# EAGLE design esp-robotics-board (EAGLE 7.5.0)
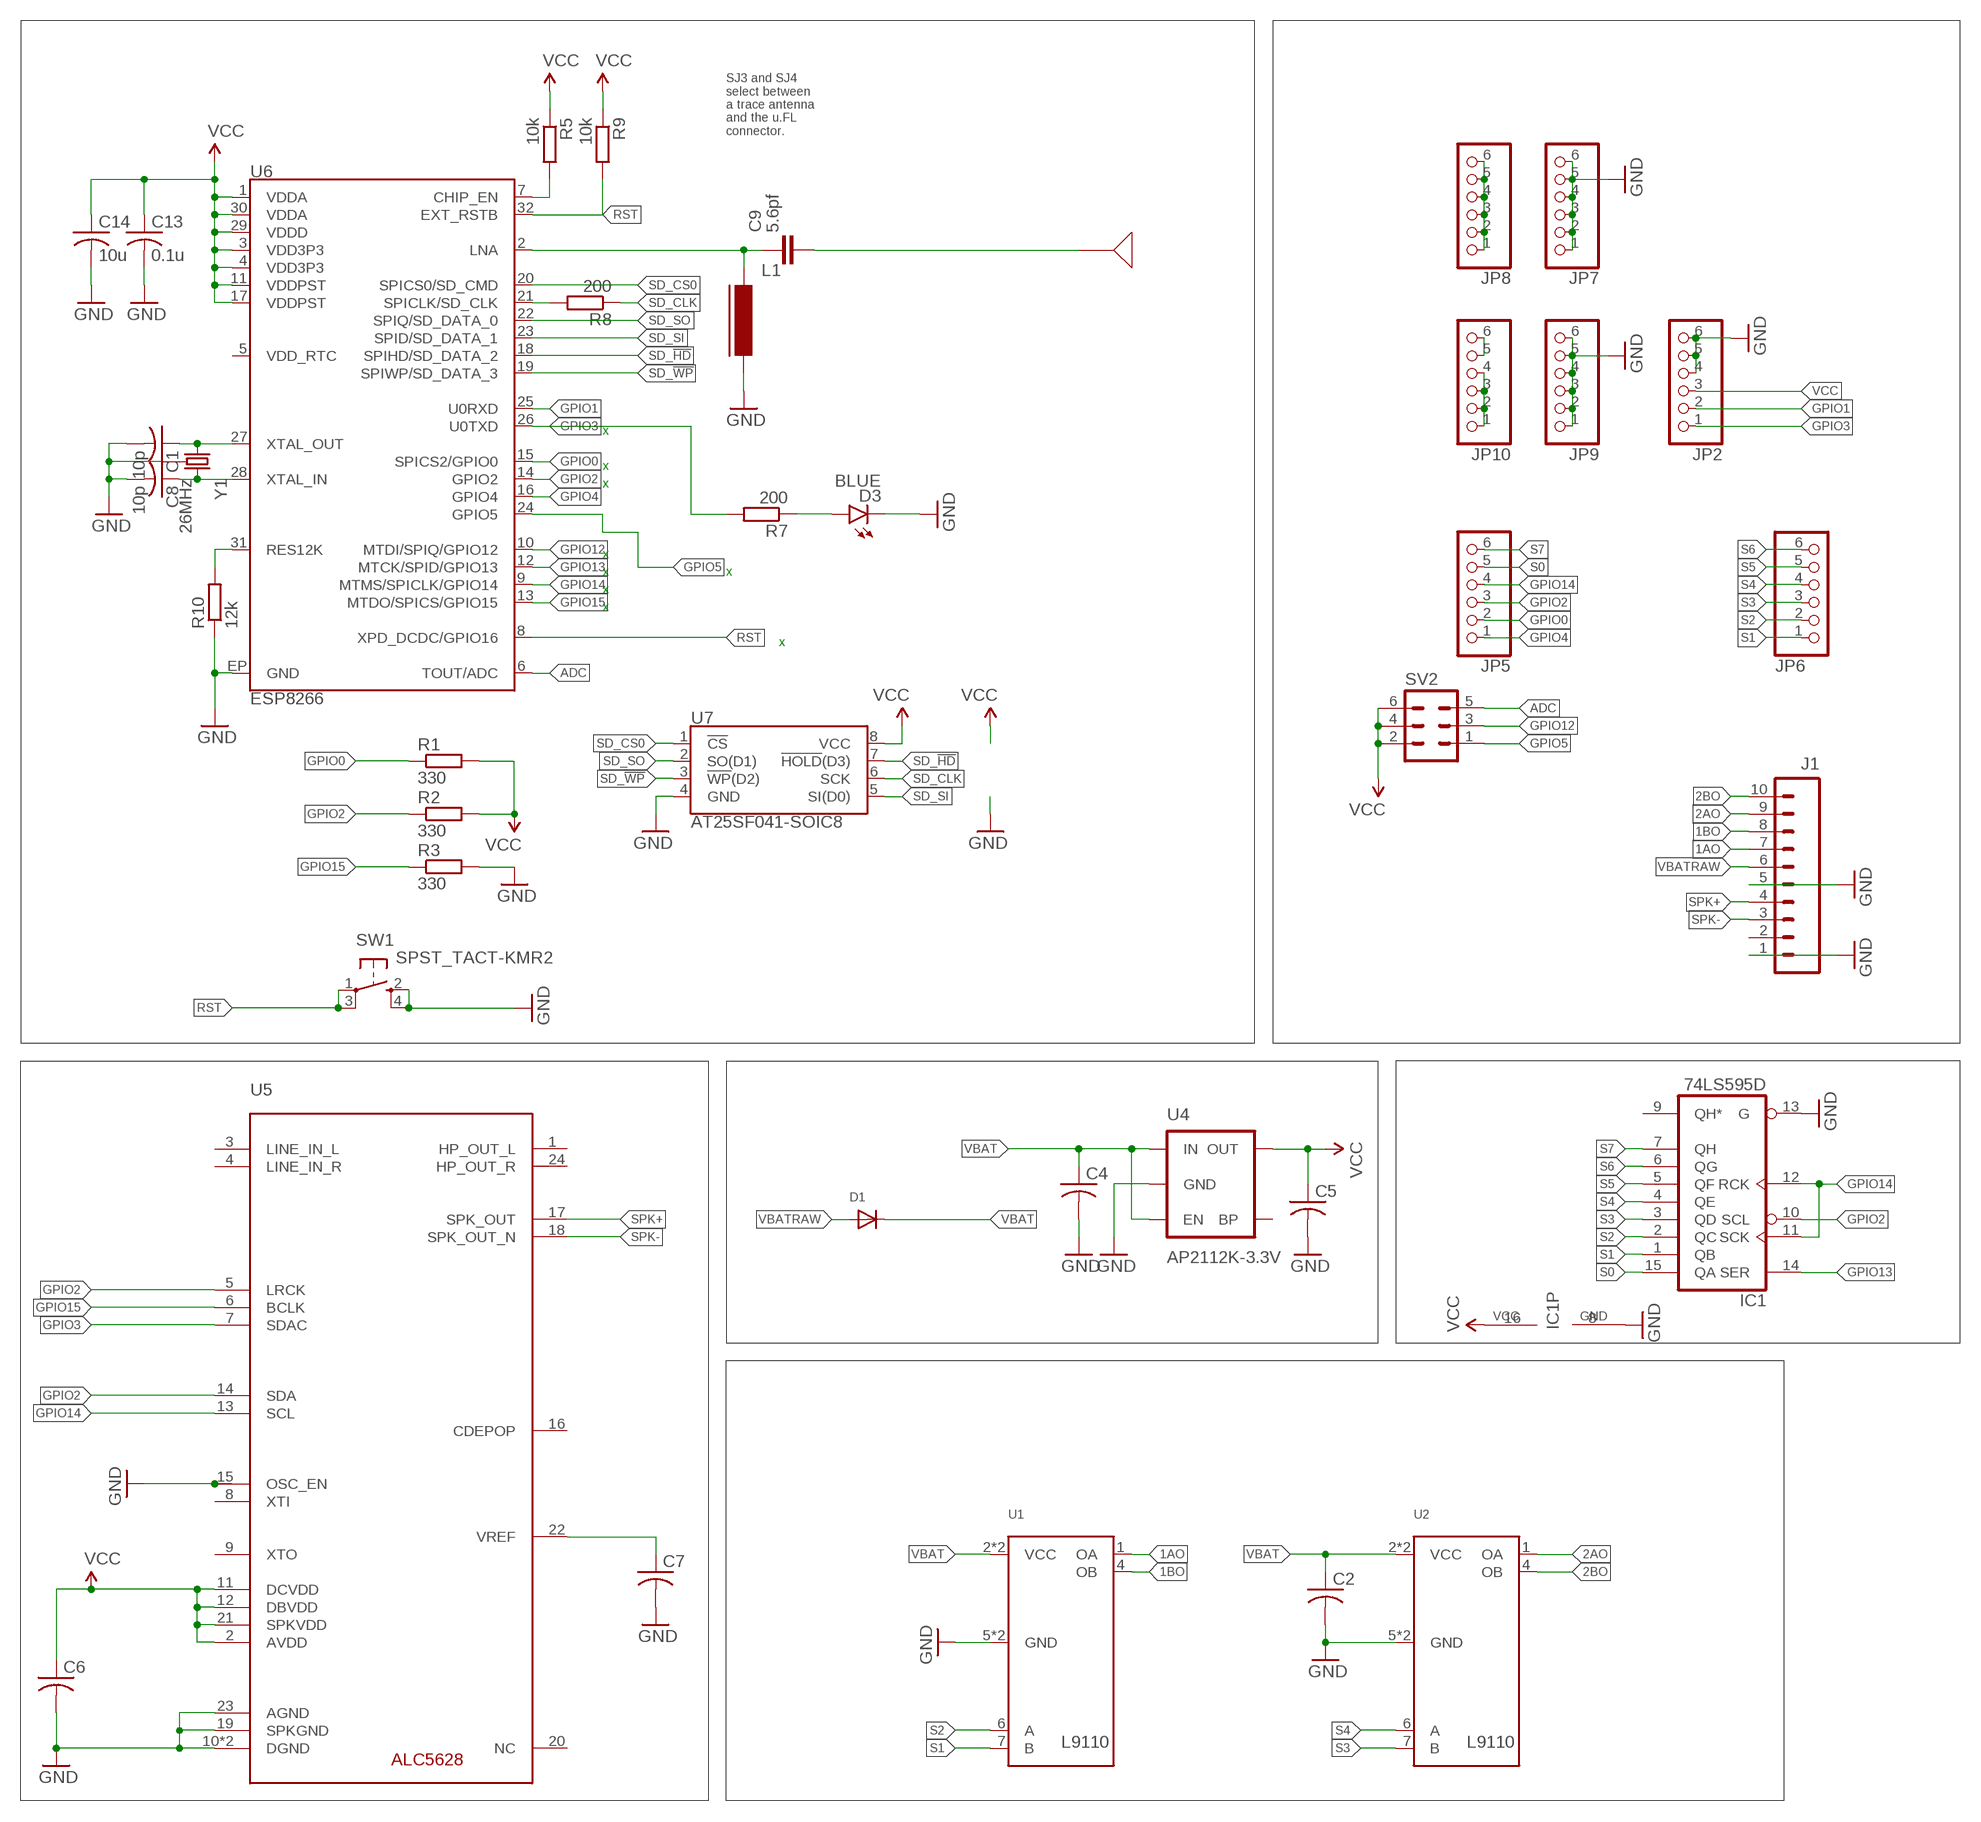
[diagram p0: schematic, sheet 1]

## Parts
C1  10p  C-USC0402  [C0402]
C2  C-USC0805  [C0805]
C4  C-USC0805  [C0805]
C5  C-USC0805  [C0805]
C6  C-USC0402  [C0402]
C7  C-USC0402  [C0402]
C8  10p  C-USC0402  [C0402]
C9  5.6pf  CAPACITOR_NPOL-0402  [C402]
C13  0.1u  C-USC0402  [C0402]
C14  10u  C-USC0402  [C0402]
D1  DIODESMA  [SMADIODE]
D3  BLUE  LED-BLUE0603  [LED-0603]
IC1  74LS595D  [SO16]
J1  M10SILK_FEMALE_PTH  [1X10]
JP2  PINHD-1X6  [1X06]
JP5  PINHD-1X6  [1X06]
JP6  PINHD-1X6  [1X06]
JP7  PINHD-1X6  [1X06]
JP8  PINHD-1X6  [1X06]
JP9  PINHD-1X6  [1X06]
JP10  PINHD-1X6  [1X06]
L1  FERRITE-0402  [FB402]
R1  330  R-EU_R0402  [R0402]
R2  330  R-EU_R0402  [R0402]
R3  330  R-EU_R0402  [R0402]
R5  10k  R-EU_R0402  [R0402]
R7  200  R-EU_R0402  [R0402]
R8  200  R-EU_R0402  [R0402]
R9  10k  R-EU_R0402  [R0402]
R10  12k  R-EU_R0402  [R0402]
SV2  MA03-2  [MA03-2]
SW1  SPST_TACT-KMR2  [KMR2]
U1  L9110SMT  [8S1]
U2  L9110SMT  [8S1]
U4  AP2112K-3.3V  V_REG_LDOSMD  [SOT23-5]
U5  ALC5628  [QFN24]
U6  ESP8266  [QFN32]
U7  AT25SF041-SOIC8  [SO08]
U$1  AN9520  [AN9520]
Y1  26MHz  CRYSTAL-GROUNDED3.2X2.5  [CRYSTAL-SMD-3.2X2.5]

## Nets
1AO: J1.7 U1.1(OA)
1BO: J1.8 U1.4(OB)
2AO: J1.9 U2.1(OA)
2BO: J1.10 U2.4(OB)
ADC: SV2.5 U6.6(TOUT/ADC)
CHIP_EN: R5.2 U6.7(CHIP_EN)
GND: C1.2 C2.2 C4.2 C5.2 C6.2 C7.2 C8.2 C13.2 C14.2 D3.C IC1.8(GND) IC1.13(G) J1.1 J1.5 JP2.4 JP2.5 JP2.6 JP7.1 JP7.2 JP7.3 JP7.4 JP7.5 JP7.6 JP9.1 JP9.2 JP9.3 JP9.4 JP9.5 JP9.6 L1.2 R3.2 R10.1 SW1.2(S) SW1.4(S1) U1.5(GND) U1.8(GND) U2.5(GND) U2.8(GND) U4.2(GND) U5.10(DGND) U5.19(SPKGND) U5.23(AGND) U5.PAD(DGND) U6.EP(GND) U7.4(GND) Y1.2(GND) Y1.4(GND)
GPIO0: JP5.2 R1.1 U6.15(SPICS2/GPIO0)
GPIO1: JP2.2 U6.25(U0RXD)
GPIO2: IC1.10(SCL) JP5.3 R2.1 U5.5(LRCK) U5.14(SDA) U6.14(GPIO2)
GPIO3: JP2.1 R7.2 U5.7(SDAC) U6.26(U0TXD)
GPIO4: JP5.1 U6.16(GPIO4)
GPIO5: SV2.1 U6.24(GPIO5)
GPIO12: SV2.3 U6.10(MTDI/SPIQ/GPIO12)
GPIO13: IC1.14(SER) U6.12(MTCK/SPID/GPIO13)
GPIO14: IC1.11(SCK) IC1.12(RCK) JP5.4 U5.13(SCL) U6.9(MTMS/SPICLK/GPIO14)
GPIO15: R3.1 U5.6(BCLK) U6.13(MTDO/SPICS/GPIO15)
LNA: C9.1 L1.1 U6.2(LNA)
LNA2: C9.2 U$1.FEED
N$1: D3.A R7.1
N$6: C7.1 U5.22(VREF)
N$10: U5.15(OSC_EN) ; supply symbol labelled GND
N$11: R10.2 U6.31(RES12K)
N$16: C8.1 U6.28(XTAL_IN) Y1.3
N$17: C1.1 U6.27(XTAL_OUT) Y1.1
RST: R9.2 SW1.1(P) SW1.3(P1) U6.8(XPD_DCDC/GPIO16) U6.32(EXT_RSTB)
S0: IC1.15(QA) JP5.5
S1: IC1.1(QB) JP6.1 U1.7(B)
S2: IC1.2(QC) JP6.2 U1.6(A)
S3: IC1.3(QD) JP6.3 U2.7(B)
S4: IC1.4(QE) JP6.4 U2.6(A)
S5: IC1.5(QF) JP6.5
S6: IC1.6(QG) JP6.6
S7: IC1.7(QH) JP5.6
SD_!HD!: U6.18(SPIHD/SD_DATA_2) U7.7(!HOLD!(D3))
SD_!WP!: U6.19(SPIWP/SD_DATA_3) U7.3(!WP!(D2))
SD_CLK: R8.1 U7.6(SCK)
SD_CLK0: R8.2 U6.21(SPICLK/SD_CLK)
SD_CS0: U6.20(SPICS0/SD_CMD) U7.1(!CS!)
SD_SI: U6.23(SPID/SD_DATA_1) U7.5(SI(D0))
SD_SO: U6.22(SPIQ/SD_DATA_0) U7.2(SO(D1))
SPK+: J1.4 U5.17(SPK_OUT)
SPK-: J1.3 U5.18(SPK_OUT_N)
VBAT: C2.1 C4.1 D1.C JP8.1 JP8.2 JP8.3 JP8.4 JP8.5 JP8.6 JP10.5 JP10.6 U1.2(VCC) U1.3(VCC) U2.2(VCC) U2.3(VCC) U4.1(IN) U4.3(EN)
VBATRAW: D1.A J1.6
VCC: C5.1 C6.1 C13.1 C14.1 IC1.16(VCC) JP2.3 JP10.1 JP10.2 JP10.3 JP10.4 R1.2 R2.2 R5.1 R9.1 SV2.2 SV2.4 SV2.6 U4.5(OUT) U5.2(AVDD) U5.11(DCVDD) U5.12(DBVDD) U5.21(SPKVDD) U6.1(VDDA) U6.3(VDD3P3) U6.4(VDD3P3) U6.11(VDDPST) U6.17(VDDPST) U6.29(VDDD) U6.30(VDDA) U7.8(VCC)
Unconnected: IC1.9(QH*) J1.2 U4.4(BP) U5.1(HP_OUT_L) U5.3(LINE_IN_L) U5.4(LINE_IN_R) U5.8(XTI) U5.9(XTO) U5.16(CDEPOP) U5.20(NC) U5.24(HP_OUT_R) U6.5(VDD_RTC)

## Notes on the sheet
- SJ3 and SJ4
  select between
  a trace antenna
  and the u.FL 
  connector.
- x
- x
- x
- x
- x | x
- x
- x
- x

## Library data of the parts
C1 C2 C4-C8 C13 C14 = adafruit:C-US: CAPACITOR, American symbol
C9 = dp_devices:CAPACITOR_NPOL: Non-Polarized capacitor in various packages
D1 = adafruit:DIODE: Diode SMADIODE - SMA Surface Mount Package 20V 1A Schottky Diode Digikey: 641-1014-6-ND DO-1N4148 - Through Hole Small Current Diode SOD-123 20V 1 A (.5mV Vf) Schottky Diode - Digikey: MBRX120TPMSCT-ND SOD-323 10V 570mA (.38mV Vf, 3ns) Schottky Diode - Digikey: ZLLS410CT-ND SOD-523 30V 30mA Schottky Diode (RB751S-40TE61) - Digikey: RB751S-40TE61CT-ND SOT23-R/W - SOT23 Package (R = Solder Paste/Reflow Ovens, W = Hand-Soldering) BAT54Film 40V 300mA - Digikey: 497-7162-1-ND
D3 = SparkFun-LED:LED-BLUE: Blue LEDs for production use Various blue LEDs stocked by SparkFun production 0603 - DIO-08575 Rebel - DIO-09553 1206 - DIO-09911; PROD_ID: DIO-08575
IC1 = 74xx-us:74*595: 8-bit SHIFT REGISTER, output latch
J1 = SparkFun-Connectors:M10: Header 10 Standard 10-pin 0.1" header. Use with straight break away headers (SKU : PRT-00116), right angle break away headers (PRT-00553), swiss pins (PRT-00743), machine pins (PRT-00117), and female headers (PRT-00115).; PROD_ID: CONN-11563
JP2 JP5-JP10 = adafruit:PINHD-1X6: PIN HEADER
L1 = dp_devices:FERRITE: Ferrite bead in various packages
R1-R3 R5 R7-R10 = rcl:R-EU_: RESISTOR, European symbol
SV2 = con-lstb:MA03-2: PIN HEADER; OC_FARNELL: unknown; OC_NEWARK: unknown
SW1 = adafruit:SPST_TACT: SMT 6mm switch, EVQQ2 series http://www.ladyada.net/library/eagle
U1 U2 = L9110h:L9110
U4 = SparkFun-PowerIC:V_REG_LDO: Voltage Regulator LDO Standard 150mA LDO voltage regulator in SOT-23 layout. Micrel part MIC5205. BP (by-pass) pin is used to lower output noise with 470pF cap.; PROD_ID: VREG-12457
U5 = ALC5628:ALC5628
U6 = esp8266-development-board:ESP8266: Espressif ESP8266 WiFi Smart Connectivity Platform.; PROD_ID: IC-12452
U7 = esp8266-development-board:AT25SF041: SPI Serial Flash Memory with Dual/Quad-IO Support Example: Adesto Technologies AT25SF041-SSHD-T (1265-1131-1-ND) <http://www.digikey.com/product-detail/en/AT25SF041-SSHD-T/1265-1131-1-ND/4824165>; PROD_ID: IC-12455
U$1 = an9520:AN9520
Y1 = things:CRYSTAL-GROUNDED; PROD_ID: XTAL-12454

## Board
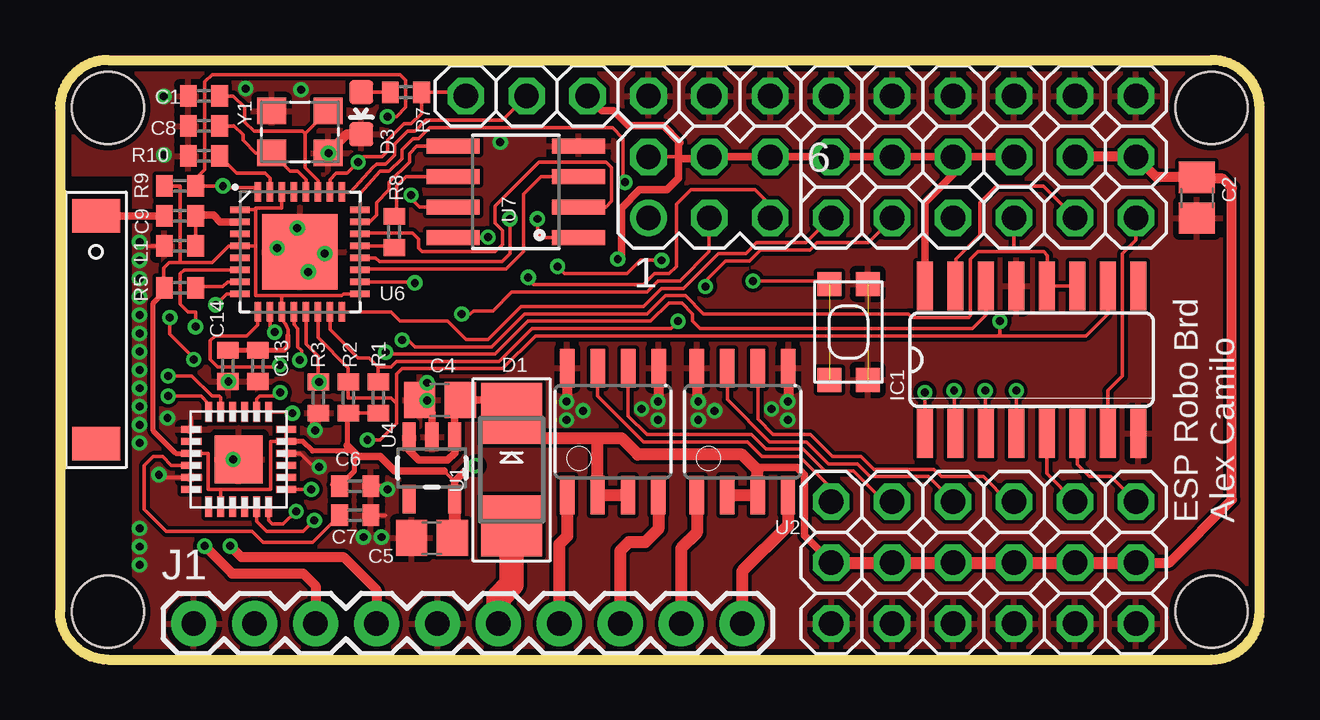
[diagram p1: board, top side]
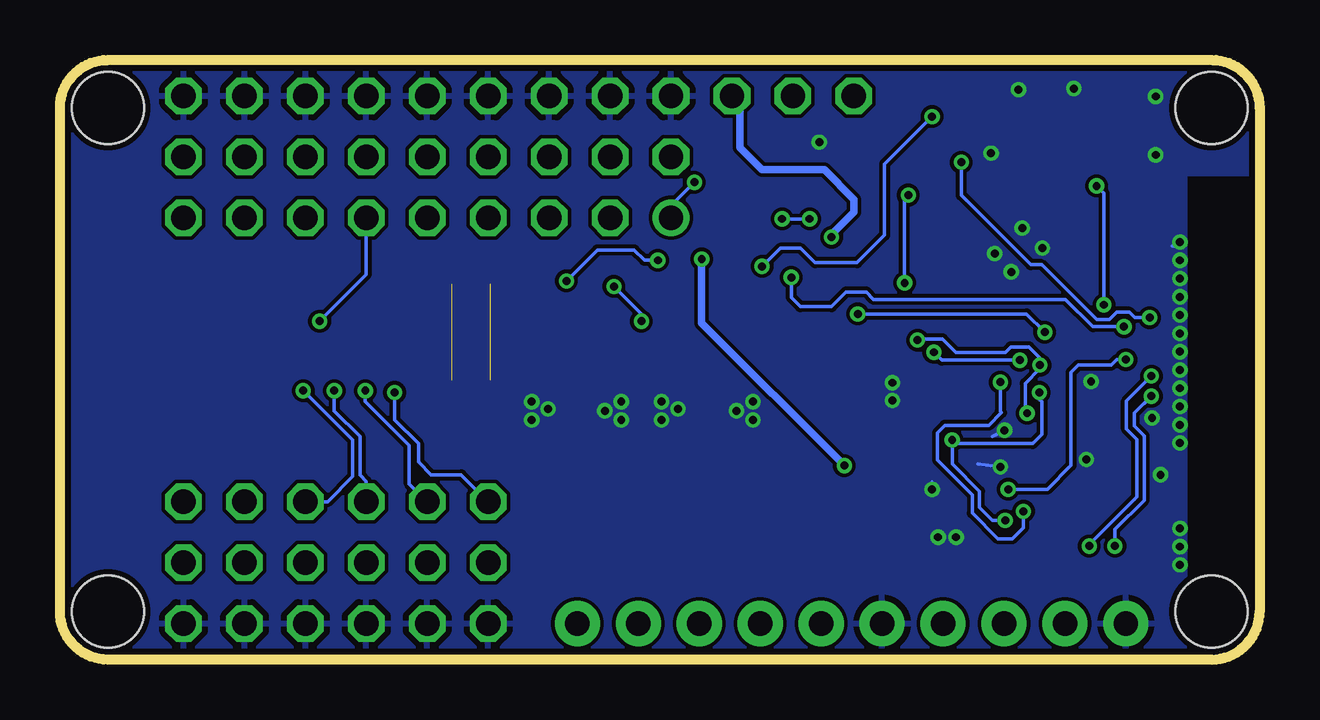
[diagram p2: board, bottom side, seen from below]

Size 50 x 25 mm. Coordinates in mm from the lower left corner, seen from the top.
Outline: 2,0 48,0 arc90 50,2 50,23 arc90 48,25 2,25 arc90 0,23 0,2 arc90 2,0
Copper layers (1*16): Top 0.035mm / dielectric 1.5mm / Bottom 0.035mm
Design rules "SeeedStudio_2layer_DRU_no_angle_20140221": minimum track width 6mil, minimum drill 12mil, track to track 6mil, track to pad 6mil, pad to pad 6mil, via to via 6mil, smd to smd 0mil, copper to edge 10mil, drill to drill 10mil, minimum pad ring 10mil, minimum via ring 6mil, stop-mask expansion 2mil, vias tented up to drill 100mil, thermal gap 10mil
Holes 3 mm at 2,23 2,2 48,2 48,23
tRestrict: area -1.1,0.3 to 3,20.1
bRestrict: area -1.1,0.3 to 3,20.1

### Footprints (pad centres in the part's own frame; a part is rotated, then mirrored left to right if it is on the bottom)
C0402 = smd 0.7 x 0.9: 1 -0.65,0; 2 0.65,0
C0805 = smd 1.3 x 1.5: 1 -0.85,0; 2 0.85,0
C402 = smd 0.7 x 0.9: 1 -0.65,0; 2 0.65,0
SMADIODE = smd 2.54 x 2.54: A 2.349,0; C -2.349,0
LED-0603 = smd 1 x 1: A 0,-0.877; C 0,0.877
SO16 = smd 0.66 x 2.032: 1 -4.445,-3.073; 2 -3.175,-3.073; 3 -1.905,-3.073; 4 -0.635,-3.073; 5 0.635,-3.073; 6 1.905,-3.073; 7 3.175,-3.073; 8 4.445,-3.073; 9 4.445,3.073; 10 3.175,3.073; 11 1.905,3.073; 12 0.635,3.073; 13 -0.635,3.073; 14 -1.905,3.073; 15 -3.175,3.073; 16 -4.445,3.073
1X10 = drill 1.016 pad 1.88: 1 0,0; 2 2.54,0; 3 5.08,0; 4 7.62,0; 5 10.16,0; 6 12.7,0; 7 15.24,0; 8 17.78,0; 9 20.32,0; 10 22.86,0
1X06 = drill 1.016 octagon: 1 -6.35,0; 2 -3.81,0; 3 -1.27,0; 4 1.27,0; 5 3.81,0; 6 6.35,0
FB402 = smd 0.7 x 0.9: 1 -0.65,0; 2 0.65,0
R0402 = smd 0.7 x 0.9: 1 -0.65,0; 2 0.65,0
MA03-2 = drill 1.016: 1 -2.54,-1.27 | drill 1.016 octagon: 2 -2.54,1.27; 3 0,-1.27; 4 0,1.27; 5 2.54,-1.27; 6 2.54,1.27
KMR2 = smd 1 x 1: 1 2,0.8; 2 2,-0.8; 3 -2,0.8; 4 -2,-0.8
8S1 = smd 0.6 x 1.6: 1 -1.905,-2.654; 2 -0.645,-2.654; 3 0.625,-2.654; 4 1.895,-2.654; 5 1.905,2.654; 6 0.635,2.654; 7 -0.635,2.654; 8 -1.905,2.654
SOT23-5 = smd 0.55 x 1.2: 1 -0.95,-1.3; 2 0,-1.3; 3 0.95,-1.3; 4 0.95,1.3; 5 -0.95,1.3
QFN24 = smd 0.85 x 0.3: 1 -1.975,1.25; 2 -1.975,0.75; 3 -1.975,0.25; 4 -1.975,-0.25; 5 -1.975,-0.75; 6 -1.975,-1.25; 13 1.975,-1.25; 14 1.975,-0.75; 15 1.975,-0.25; 16 1.975,0.25; 17 1.975,0.75; 18 1.975,1.25 | smd 0.3 x 0.85: 7 -1.25,-1.975; 8 -0.75,-1.975; 9 -0.25,-1.975; 10 0.25,-1.975; 11 0.75,-1.975; 12 1.25,-1.975; 19 1.25,1.975; 20 0.75,1.975; 21 0.25,1.975; 22 -0.25,1.975; 23 -0.75,1.975; 24 -1.25,1.975 | smd 2 x 2: PAD 0,0
QFN32 = smd 0.8 x 0.285: 1 -2.5,1.75; 2 -2.5,1.25; 3 -2.5,0.75; 4 -2.5,0.25; 5 -2.5,-0.25; 6 -2.5,-0.75; 7 -2.5,-1.25; 8 -2.5,-1.75; 17 2.5,-1.75; 18 2.5,-1.25; 19 2.5,-0.75; 20 2.5,-0.25; 21 2.5,0.25; 22 2.5,0.75; 23 2.5,1.25; 24 2.5,1.75 | smd 0.285 x 0.8: 9 -1.75,-2.5; 10 -1.25,-2.5; 11 -0.75,-2.5; 12 -0.25,-2.5; 13 0.25,-2.5; 14 0.75,-2.5; 15 1.25,-2.5; 16 1.75,-2.5; 25 1.75,2.5; 26 1.25,2.5; 27 0.75,2.5; 28 0.25,2.5; 29 -0.25,2.5; 30 -0.75,2.5; 31 -1.25,2.5; 32 -1.75,2.5 | smd 3.15 x 3.15: EP 0,0
SO08 = smd 0.61 x 2.21: 1 -1.905,-2.616; 2 -0.635,-2.616; 3 0.635,-2.616; 4 1.905,-2.616; 5 1.905,2.616; 6 0.635,2.616; 7 -0.635,2.616; 8 -1.905,2.616
AN9520 = smd 1.4 x 2: FEED 4.75,0; MNT -4.75,0
CRYSTAL-SMD-3.2X2.5 = smd 1.2 x 1.1: 1 -1.175,-0.875; 2 1.175,-0.875; 3 1.175,0.875; 4 -1.175,0.875

### Placement (x,y rotation side)
C1  6,23.5 180 top
C2  47.39,19.26 270 top
C4  15.84,10.82 180 top
C5  15.5,5.06 180 top
C6  12.31,7.23 0 top
C7  12.31,6.02 0 top
C8  6,22.25 180 top
C9  5,18.5 180 top
C13  8.25,12.25 270 top
C14  7,12.25 270 top
D1  18.83,7.92 270 top
D3  12.56,22.78 180 top
IC1  40.5,12.5 0 top
J1  5.57,1.5 0 top
JP2  23.26,23.5 0 top
JP5  38.5,18.42 0 top
JP6  38.5,6.58 0 top
JP7  38.5,1.5 0 top
JP8  38.5,4.04 0 top
JP9  38.5,23.5 0 top
JP10  38.5,20.96 0 top
L1  5,17.25 180 top
R1  13.27,10.92 270 top
R2  12.02,10.92 270 top
R3  10.77,10.92 270 top
R5  5,15.5 0 top
R7  14.42,23.65 0 top
R8  13.93,17.83 270 top
R9  5,19.75 0 top
R10  6,21 0 top
SV2  27.07,19.69 0 top
SW1  32.87,13.66 90 top
U1  23.05,9.5 0 top
U2  28.45,9.5 0 top
U4  15.5,7.99 180 top
U5  7.45,8.35 90 top
U6  10,17 0 top
U7  19,19.5 90 top
U$1  1.5,13.75 90 top
Y1  10,22 180 top

### Tracks (layer width: path | path; a pad name or v marks a point on that pad's centre or on a via)
1AO
  Top 0.508: U1.1 21.14,5.14 20.81,4.81 J1.7
1BO
  Top 0.508: U1.4 24.95,5.44 24.39,4.89 23.71,4.89 23.35,4.53 J1.8
2AO
  Top 0.508: U2.1 26.55,5.29 25.89,4.63 J1.9
2BO
  Top 0.508: U2.4 30.34,5.58 28.43,3.67 J1.10
ADC  (via drill 0.33)
  Top 0.152: U6.6 7.47,16.25 7.25,16.24 5.17,16.24 5.02,16.09 5.02,14.81 5.34,14.49 5.65,14.49 v5.65,13.88 | v19.52,15.94 19.52,15.71 19.59,15.78 19.75,15.63 24.32,15.63 24.77,16.09 25.38,16.09 25.69,16.39 25.69,18.98 26.3,19.59 28.96,19.59 29.61,18.95 SV2.5
  Bottom 0.152: v19.52,15.94 19.52,15.1 19.14,14.72 17.84,14.72 17.23,15.33 16.39,15.33 16.09,15.02 8.09,15.02 6.94,13.88 v5.65,13.88
CHIP_EN
  Top 0.152: 5.9,15.75 R5.2 5.7,15.55 6.79,15.55 6.99,15.75 U6.7
GND  (via drill 0.33)  (1 unrouted)
  Top 0.152: R3.2 10.49,9.85 v10.63,9.56 | L1.2 3.59,17.25 3.57,17.23 | C6.2 13.63,7.23 v13.65,7.1 | C7.2 13.56,6.02 | U5.23 4.31,7.6 v4.12,7.71 | U5.19 5.47,10.12 | U5.10 10.01,8.6 10.45,8.16
  Top 0.305: U4.2 15.5,10.31 C4.2
  Top 0.406: U1.8 21.14,10.78 v21.12,10.75 | U1.5 24.95,10.78 v24.93,10.75 | U2.8 26.55,10.81 v26.6,10.75 | U2.5 30.36,10.77 v30.34,10.75 | Y1.4 11.95,21.9 D3.C
  Bottom 0.152: v10.63,9.56 11.13,9.31 | 3.57,17.23 3.65,17.23 | v13.65,7.1 13.65,7.4 | v4.12,7.71 4.05,7.78 | v10.8,8.04 11.74,8.16
  Bottom 0.406: v21.12,10.75 21.19,10.83 | v24.93,10.75 24.93,10.68 | v26.6,10.75 26.6,10.68 | v30.34,10.75 30.26,10.75
  other vias: 13.4,5.11 12.65,5.11 21.12,9.99 21.8,10.37 24.93,9.99 24.24,10.45 26.6,9.99 27.29,10.37 30.34,9.99 29.65,10.45 4.48,10.07 9.89,17.99 9.06,17.15 11.04,16.93 10.35,16.16 10.05,23.76 7.74,23.81 11.19,21.12 4.33,23.48 4.33,21.04 7.02,11.59 7.22,8.34 3.32,9.79 3.32,10.55 3.32,11.31 3.32,12.07 3.32,12.84 3.32,13.6 3.32,14.36 3.32,15.12 3.32,15.88 3.32,16.65 3.32,17.41 3.32,9.03 3.32,5.47 3.32,4.71 3.32,3.95 18.35,21.57 15.3,11.54 15.3,10.8
  pour Bottom: -2.05,26.91 53.27,26.91 53.27,-4.18 -1.82,-4.18 -1.82,19.82
  pour Top: -1.44,28.36 54.49,28.36 54.49,-3.42 -1.36,-3.42 -1.36,26.53
GPIO0  (via drill 0.33)
  Top 0.152: U6.15 11.25,13.76 12.43,12.58 12.89,12.58 13.27,12.2 | 13.27,12.2 R1.1 | 13.27,12.2 13.8,12.2 14.03,12.43 18.3,12.43 19.67,13.8 25.46,13.8 v25.77,14.11 | v26.91,15.55 26.91,15.78 27.75,16.62 28.74,16.62 29.19,17.08 31.25,17.08 31.56,17.38 33.69,17.38 34.69,18.38 JP5.2
  Bottom 0.152: v25.77,14.11 25.77,14.41 v26.91,15.55
GPIO1
  Top 0.152: U6.25 12.11,19.5 13.04,20.51 13.19,20.66 13.57,20.66 13.95,21.04 13.95,21.5 14.49,22.03 14.79,22.03 15.25,22.49 18.44,22.49 JP2.2
GPIO2  (via drill 0.33)
  Top 0.152: U6.14 10.75,13.42 12.02,12.15 R2.1 12.02,10.91 13.8,10.91 14.03,10.68 | U5.5 8.2,5.76 8.62,5.34 10.14,5.34 v10.6,5.8 | v12.81,9.15 13.34,9.15 14.03,9.84 14.03,10.68 | IC1.10 43.67,14.41 42.76,13.5 39.1,13.5 | 14.03,10.68 14.03,11.9 14.26,12.12 18.45,12.12 19.82,13.5 39.1,13.5 | v39.18,14.11 39.18,13.57 39.1,13.5 | U5.14 8.2,10.87 8.32,10.98 9,10.98 v9.18,11.13
  Bottom 0.152: v10.6,5.8 11.13,5.8 11.67,6.33 11.67,7.02 12.81,8.16 v12.81,9.15 12.66,9 9.46,9 9.08,9.38 9.08,10.75 9.15,10.83 v9.18,11.13 | JP5.3 37.23,16.05 v39.18,14.11
GPIO3  (via drill 0.33)
  Top 0.152: U5.7 v10.47,7.1 | U6.26 11.25,20.01 11.52,20.28 11.97,20.28 v12.43,20.74 12.66,20.96 13.42,20.96 13.65,21.19 13.65,21.65 14.34,22.34 14.64,22.34 15.07,22.77 R7.2 16.76,23.65 JP2.1 16.81,23.4 | v5.57,12.51 5.57,12.58 4.58,13.57 v4.58,14.26
  Bottom 0.152: 10.47,7.15 v10.47,7.1 8.85,7.1 7.86,8.09 7.86,11.97 7.55,12.28 6.18,12.28 5.95,12.51 v5.57,12.51 | v12.43,20.74 12.43,19.36 9.53,16.47 9.08,16.47 6.79,14.18 6.26,14.18 5.95,14.49 5.42,14.49 5.19,14.26 v4.58,14.26
GPIO4
  Top 0.152: U6.16 11.76,14.49 13.8,14.49 14.18,14.11 16.16,14.11 16.93,13.34 17.84,13.34 19.21,14.72 24.32,14.72 25.08,15.48 25.99,15.48 27.44,16.93 28.58,16.93 29.04,17.38 31.1,17.38 32.14,18.42 JP5.1
GPIO5  (via drill 0.33)
  Top 0.152: U6.24 12.5,19.43 13.34,20.36 13.72,20.36 14.26,20.89 14.26,21.27 14.72,21.73 14.95,21.73 15.4,22.18 23.02,22.18 23.48,21.73 23.48,20.05 23.55,19.97 v23.55,19.9
  Bottom 0.152: v23.55,19.9 24.55,18.91 24.55,18.4 | 24.55,18.37 24.55,18.4 | 24.55,18.4 SV2.1
GPIO12  (via drill 0.33)
  Top 0.152: U6.10 8.75,13.88 v8.95,13.65 | v16.75,14.41 17.1,14.41 17.23,14.54 18.04,14.54 18.83,15.33 24.47,15.33 24.93,15.78 25.84,15.78 27.06,17 SV2.3
  Bottom 0.152: v16.75,14.41 9.71,14.41 v8.95,13.65
GPIO13  (via drill 0.33)
  Top 0.152: U6.12 9.75,13.97 9.91,13.8 9.91,13.04 10.07,12.89 10.07,12.51 v9.99,12.48 | v13.57,12.81 13.65,12.73 18.14,12.73 19.52,14.11 24.62,14.11 25.38,14.87 25.92,14.87 26.38,14.41 26.38,14.11 26.68,13.8 38.03,13.8 38.59,14.36 IC1.14
  Bottom 0.152: 13.27,12.51 v13.57,12.81 13.24,12.48 v9.99,12.48
GPIO14  (via drill 0.33)
  Top 0.152: U6.9 8.24,13.95 7.78,13.5 6.46,13.5 6.26,13.29 6.26,12.51 6.56,12.2 9.08,12.2 v9.15,12.28 | U5.13 9.58,10.32 v9.69,10.27 | v14.26,13.32 14.49,13.34 14.79,13.04 17.99,13.04 19.36,14.41 24.47,14.41 25.23,15.17 26.07,15.17 26.83,14.41 35.37,14.41 35.52,14.26 37.88,14.26 37.96,14.34 37.96,16.7 38.26,17 39.63,17 | IC1.11 IC1.12 41.16,15.6 41.16,16.85 41.01,17 39.63,17 | JP5.4 39.77,17.14 39.63,17
  Bottom 0.152: 9.76,10.22 v9.69,10.27 9.76,10.35 9.76,11.52 9.15,12.12 v9.15,12.28 9.15,12.58 9.61,13.04 10.37,13.04 10.6,12.81 12.66,12.81 13.22,13.37 14.26,13.37 v14.26,13.32
GPIO15  (via drill 0.33)
  Top 0.152: U5.6 8.7,5.8 8.85,5.65 9.31,5.65 v9.84,6.18 | U6.13 10.25,13.16 10.75,12.66 10.75,11.59 R3.1 v10.8,11.57
  Bottom 0.152: v9.84,6.18 9.84,5.5 10.3,5.04 10.91,5.04 11.97,6.11 11.97,6.87 13.42,8.32 13.42,9.46 13.12,9.76 11.29,9.76 10.75,10.3 10.8,10.35 v10.8,11.57
LNA
  Top 0.152: 5.9,18.25 C9.1 L1.1
  Top 0.305: U6.2 6.69,18.25 6.41,18.53 5.68,18.53 C9.1
LNA2
  Top 0.305: C9.2 U$1.FEED
N$1
  Top 0.152: D3.A R7.1
N$6
  Top 0.152: U5.22 4.64,8.1 4.28,8.47 3.9,8.47 3.52,8.09 3.52,6.26 4.43,5.34 8.01,5.34 8.47,4.89 10.52,4.89 C7.1
N$11
  Top 0.152: U6.31 8.75,20.07 8.54,20.28 7.37,20.28 R10.2
N$16
  Top 0.152: U6.28 10.25,20.02 9.91,20.36 9.6,20.36 Y1.3 8.16,21.12 7.63,21.65 7.63,21.88 7.25,22.26 7.24,22.25 C8.1
N$17
  Top 0.152: U6.27 10.75,19.98 10.22,20.51 10.22,21.92 | 10.22,21.92 Y1.1 | 10.22,21.92 10.11,22.03 8.09,22.03 7.71,22.41 7.71,23.02 7.23,23.5 C1.1
RST  (via drill 0.33)  (1 unrouted)
  Top 0.152: 8.19,19.44 U6.32 8.08,19.67 6.79,19.67 v6.79,19.75 R9.2 5.65,20.05 6.03,20.43 6.03,24.09 6.33,24.39 14.18,24.39 14.41,24.16 14.41,23.02 14.03,22.64 v13.65,22.64 | U6.8 6.94,15.25 v6.49,14.79 | v20.74,16.39 21.04,16.09 23.63,16.09 24.19,16.65 v25.08,16.65 | v28.89,15.78 31.94,15.78 SW1.1
  Bottom 0.152: v6.79,19.75 6.49,19.44 v6.49,14.79 | v13.65,22.64 15.63,20.66 15.63,17.69 16.77,16.55 18.53,16.55 19.14,17.15 19.97,17.15 v20.74,16.39 | v25.08,16.65 25.64,16.65 26.07,17.08 27.59,17.08 v28.89,15.78
S0
  Top 0.152: IC1.15 37.35,15.55 37.35,16.7 38.34,17.69 38.34,19.06 39.02,19.75 40.98,19.75 JP5.5
S1  (via drill 0.33)
  Top 0.152: U1.7 22.41,10.98 24.32,9.08 28.66,9.08 29.27,8.47 30.82,8.47 32.17,7.11 JP6.1 | IC1.1 v36.05,11.13
  Bottom 0.152: v36.05,11.13 36.05,9.99 35.06,9 35.06,8.24 34.53,7.71 33.28,7.71 JP6.1
S2  (via drill 0.33)
  Top 0.152: IC1.2 37.27,9.48 v37.27,11.21 | U1.6 23.68,10.17 24.47,9.38 28.81,9.38 29.42,8.77 30.97,8.77 31.89,7.86 33.08,7.86 34.36,6.58 JP6.2
  Bottom 0.152: 37.27,11.29 v37.27,11.21 37.27,10.75 35.44,8.93 35.44,7.33 JP6.2
S3  (via drill 0.33)
  Top 0.152: U2.7 27.82,10.84 29.57,9.08 31.12,9.08 32.04,8.16 33.23,8.16 33.77,7.63 36.2,7.63 37.23,6.6 JP6.3 | IC1.3 38.57,9.46 v38.57,11.21
  Bottom 0.152: 38.57,11.29 v38.57,11.21 38.57,10.37 37.5,9.31 37.5,7.71 37.23,7.44 JP6.3
S4  (via drill 0.33)
  Top 0.152: U2.6 29.09,10.02 29.73,9.38 31.28,9.38 32.19,8.47 33.38,8.47 33.92,7.93 36.43,7.93 36.74,7.63 38.49,7.63 39.54,6.58 JP6.4 | IC1.4 v39.86,11.21
  Bottom 0.152: JP6.4 38.85,6.58 37.8,7.63 37.8,9.15 v39.86,11.21
S5
  Top 0.152: IC1.5 41.13,7.75 JP6.5
S6
  Top 0.152: IC1.6 42.41,8.13 42.91,7.63 43.8,7.63 JP6.6
S7
  Top 0.152: JP5.6 44.85,17.49 44.28,16.93 44.28,11.82 43.67,11.21 IC1.7
SD_!HD!  (via drill 0.33)
  Top 0.152: U6.18 14.67,15.75 v14.79,15.71 | v14.64,19.36 14.64,19.21 14.99,18.86 U7.7
  Bottom 0.152: v14.79,15.71 14.79,19.21 v14.64,19.36
SD_!WP!
  Top 0.152: U7.3 21.61,20.13 20.05,20.13 19.31,19.41 19.31,17 18.59,16.27 12.53,16.27 U6.19
SD_CLK
  Top 0.152: R8.1 14.03,18.48 14.03,19.75 14.42,20.14 U7.6
SD_CLK0
  Top 0.152: U6.21 13.94,17.25 R8.2
SD_CS0  (via drill 0.33)
  Top 0.152: U7.1 20.07,17.59 19.9,17.76 v19.9,18.37 | v18.75,18.37 18.75,16.93 18.42,16.6 13.32,16.6 13.16,16.75 U6.20
  Bottom 0.152: v19.9,18.37 v18.75,18.37
SD_SI
  Top 0.152: U7.5 14.87,21.41 14.56,21.1 14.56,20.74 13.72,19.9 13.72,19.59 13.19,19.06 13.19,18.53 12.92,18.25 U6.23
SD_SO
  Top 0.152: U7.2 22.75,18.86 23,19.11 23,20.51 22.77,20.74 19.97,20.74 18.14,18.91 18.14,18.2 18.45,17.89 18.45,17.31 18.14,17 15.1,17 14.95,17.15 14.95,17.54 14.69,17.79 12.81,17.79 12.77,17.75 U6.22
SPK+  (via drill 0.33)
  Top 0.152: U5.17 6.7,10.92 6.64,10.98 6.33,10.98 5.5,11.82 v4.5,11.82
  Top 0.406: v7.1,4.73 7.55,4.28 11.82,4.28 13.19,2.91 J1.4
  Bottom 0.152: v7.1,4.73 7.1,4.81 5.12,6.79 5.12,9.18 5.55,9.61 5.55,10.78 v4.5,11.82
SPK-  (via drill 0.33)
  Top 0.152: U5.18 6.2,10.66 5.88,10.98 v4.5,10.98
  Top 0.406: v6.03,4.73 7.17,3.59 10.14,3.59 10.65,3.08 J1.3
  Bottom 0.152: v6.03,4.73 6.03,5.42 4.81,6.64 4.81,9.33 5.22,9.74 5.22,10.27 v4.5,10.98 4.81,10.68
VBAT
  Top 0.152: D1.C 18.27,10.82 18.14,10.82
  Top 0.305: U4.3 14.55,8.71 14.95,8.32 16.16,8.32 16.47,8.62 16.47,9.27 U4.1 16.45,10.59 C4.1 18.14,10.82 18.14,10.83 | JP8.1 31.02,5.17 31.02,7.71 30.72,8.01 29.18,8.01 29.07,7.9
  Top 0.406: JP8.6 46.23,4.04 48.85,6.66 48.85,19.67 48.47,20.05 47.45,20.05 C2.1 45.7,20.11 JP10.6 JP10.5
  Top 0.508: D1.C 19.79,9.23 22.26,9.23 | 22.26,9.23 23.4,9.23 24.09,8.54 28.43,8.54 29.07,7.9 U2.3 U2.2 | 22.26,9.23 22.41,9.08 U1.2 U1.3 | JP8.1 JP8.2 JP8.3 JP8.4 JP8.5 JP8.6
  Top 0.61: U4.3 14.55,9.17
VBATRAW
  Top 0.508: 18.27,5.09 D1.A
  Top 1.016: J1.6 18.27,2.58 18.83,3.13 D1.A
VCC  (via drill 0.33)
  Top 0.152: U6.4 U6.3 | 8.16,18.75 U6.1 | 8.16,18.75 8.16,18.83 9.23,18.83 9.23,19.48 U6.30 U6.29 | 8.16,18.75 8.16,17.23 | 8.16,17.23 8.16,15.17 9.23,15.17 | 9.23,15.17 9.23,14.52 U6.11 9.25,14.16 9.41,13.98 9.46,13.88 9.48,13.8 9.51,13.75 9.51,13.52 | 9.23,15.17 11.74,15.17 11.82,15.25 U6.17 | 5.02,16.55 4.56,16.55 4.33,16.32 4.33,15.52 R5.1 | U5.12 U5.11 8.77,9.1 8.77,7.1 6.7,7.1 | U5.21 6.18,8.6 6.18,7.1 6.7,7.1 | U5.2 6.7,7.1 | R1.2 R2.2 11.97,10.22 | 11.52,8.7 11.59,8.7 | R9.1 5.02,19.75 5.02,16.55 | U6.4 8.14,17.25 8.16,17.23 | 5.02,16.55 6.33,16.55 7.04,17.25 U6.4 | SV2.2 25.76,20.96 25.79,20.99 | 11.52,7.45 11.52,7.37 C6.1 | 16.01,7.86 16.45,7.42
  Top 0.203: 11.97,8.7 12.28,8.7 12.28,7.86 11.87,7.45 11.52,7.45 11.36,7.3 | 11.97,8.7 11.52,8.7 10.53,8.7 10.12,9.1 U5.11 | 11.97,10.22 11.97,8.93 11.97,8.7 | U5.21 4.83,8.6 3.9,9.53 3.9,14.87 4.35,15.32 R5.1 | C13.1 8.71,12.9 | 6.99,12.89 C14.1 C13.1 | C13.1 9.34,12.9 9.51,13.06 9.51,13.52 | U7.8 v17.84,17.61
  Top 0.305: U4.5 16.45,7.42 17.12,8.09 v17.31,8.09 | 16.01,7.86 13.95,7.86 13.34,8.47 12.43,8.47 11.97,8.93 | 23.25,16.62 v23.25,16.7 23.4,16.77 23.4,18.83 24.16,19.59 25.31,19.59 25.79,20.07 25.79,20.89 | 25.79,20.89 25.79,20.99 25.79,21.5 25.85,21.56 25.16,22.26 23.71,22.26 23.07,22.89 22.59,22.89 JP2.3 | JP10.3 JP10.2 JP10.1 SV2.6 SV2.4 27,20.89 25.79,20.89 | JP10.3 JP10.4 | JP10.3 37.23,20.24 36.05,19.06 36.05,17.23 IC1.16
  Top 0.508: U4.5 16.45,5.85 C5.1
  Bottom 0.305: v17.31,8.09 23.25,14.03 v23.25,16.7 | v17.84,17.61 17.84,17.71 16.9,18.65 16.9,19.19 18.14,20.43 20.74,20.43 21.65,21.34 21.65,23.16 | 21.65,23.16 JP2.3 | 21.65,23.16 21.65,23.17 JP2.3

### Text on the board
tPlace: ESP Robo Brd / Alex Camilo
Reference: GPIO3 | GPIO1 | GPIO5 | GPIO12 | ADC | GPIO4 | GPIO0 | GPIO2 | GPIO14 | Servo | Servo | Dual L9110 / H-Bridges | ESP8266 | 74hc595 / ShiftReg | ALC5628 | Servo | Servo | Servo | Servo | Servo | Servo | Speaker+ | speaker- | Battery- | Battery+ | Motor1 | Motor1 | Motor2 | Motor2